# EAGLE design Brain Conn Disconnect (6 - straight) (EAGLE 9.6.2)
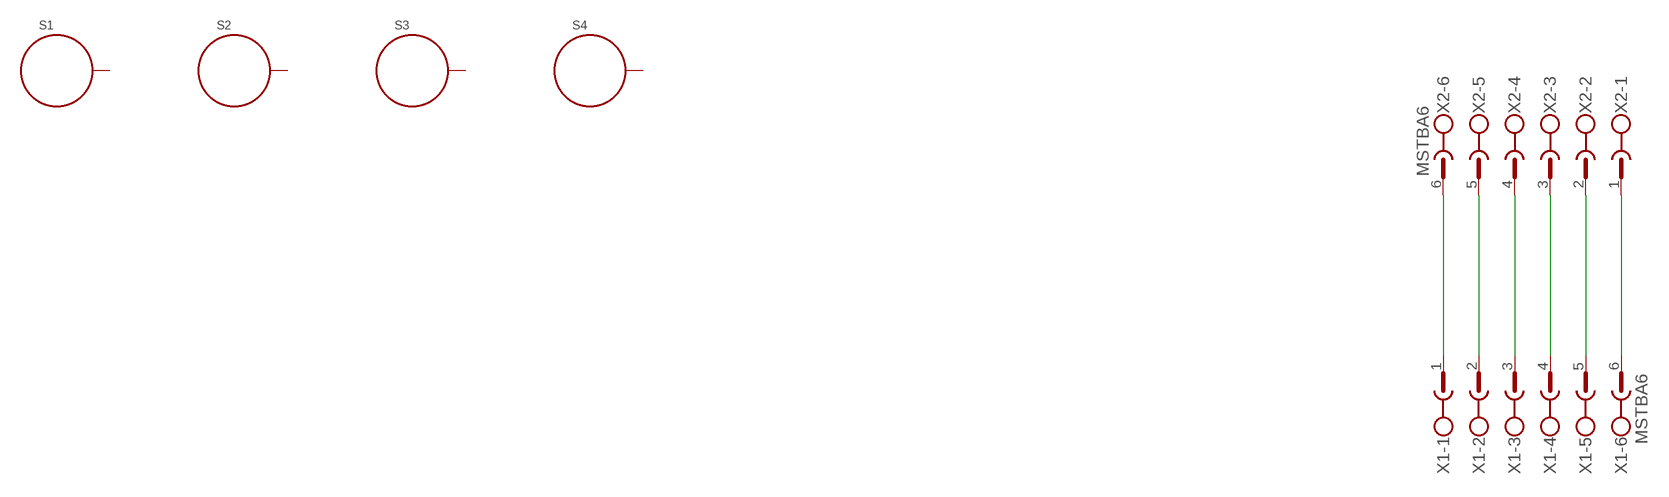
[diagram p0: schematic, sheet 1]

## Parts
S1  STANDOFF_ELECTRICAL144  [STANDOFF_ELECTRICAL_144MILL_NORMAL_SCREW]
S2  STANDOFF_ELECTRICAL144  [STANDOFF_ELECTRICAL_144MILL_NORMAL_SCREW]
S3  STANDOFF_ELECTRICAL144  [STANDOFF_ELECTRICAL_144MILL_NORMAL_SCREW]
S4  STANDOFF_ELECTRICAL144  [STANDOFF_ELECTRICAL_144MILL_NORMAL_SCREW]
X1  MSTBA6  [MSTBA6]
X2  MSTBA6  [MSTBA6]

## Nets
N$1: X1.1 X2.6
N$2: X1.2 X2.5
N$3: X1.3 X2.4
N$4: X1.4 X2.3
N$5: X1.5 X2.2
N$6: X1.6 X2.1
Unconnected: S1.P1 S2.P1 S3.P1 S4.P1

## Library data of the parts
S1-S4 = th_libraries:STANDOFF_ELECTRICAL: A standoff intended to be an electrically connected point. Pad size and stop size allow for a #8 Phillips pan screw head to make a solid connection to the board. Added 144mill drill hole that fits my normal wood screw
X1 X2 = con-phoenix-508:MSTBA6: PHOENIX; MF: FARNELL; MPN: 1757284; OC_FARNELL: 3705213; OC_NEWARK: 71C4165

## Board
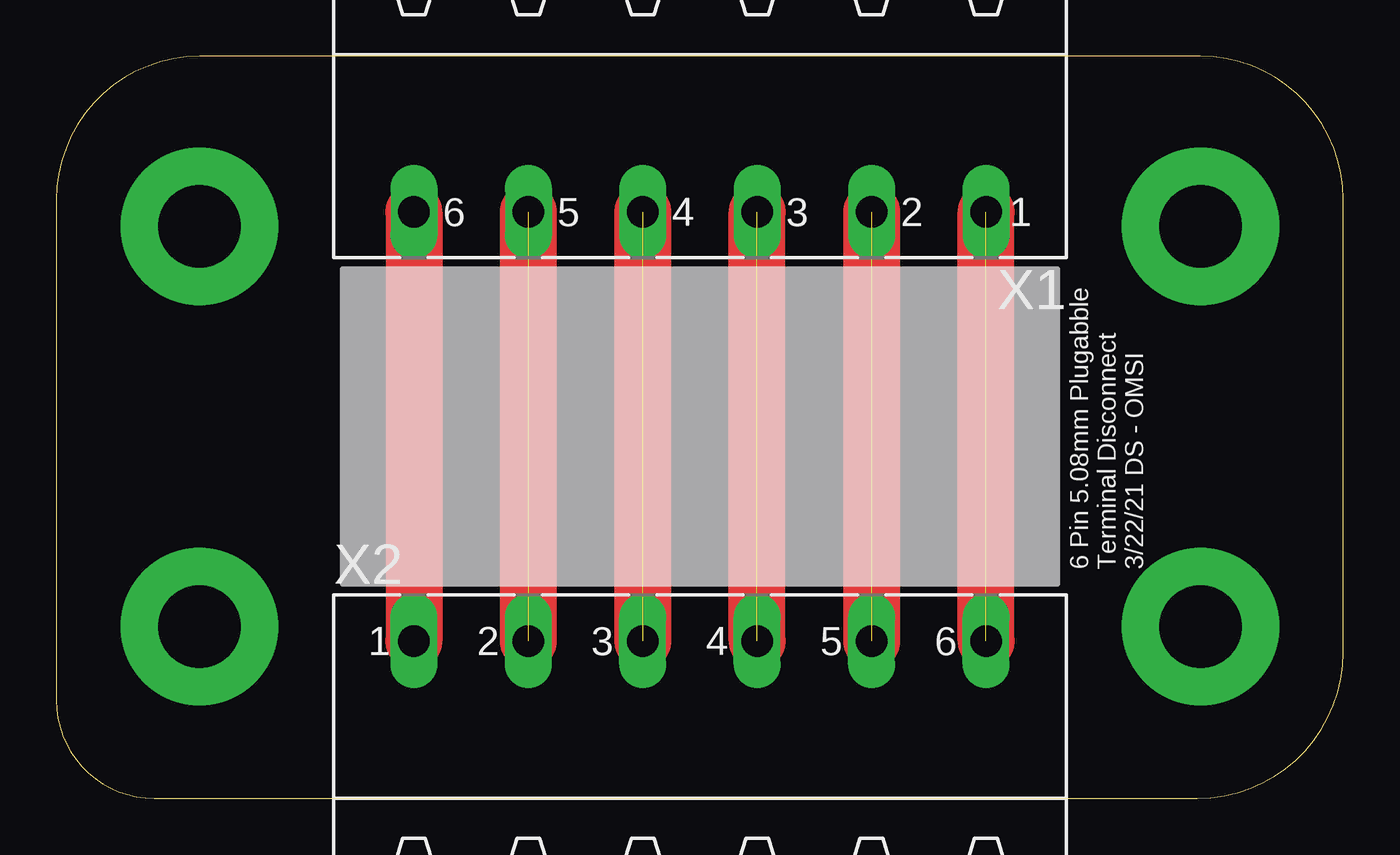
[diagram p1: board, top side]

Size 57.13 x 32.94 mm. Coordinates in mm from the lower left corner, seen from the top.
Outline: 57.13,6.47 57.13,26.6 arc90 50.79,32.94 6.37,32.94 arc90 0,26.57 0,4.34 arc90 4.34,0 50.66,0 arc90 57.13,6.47
Copper layers (1*16): Top 0.035mm / dielectric 1.5mm / Bottom 0.035mm
Design rules "default": minimum track width 6mil, minimum drill 0.35mm, track to track 6mil, track to pad 6mil, pad to pad 6mil, via to via 6mil, smd to smd 6mil, copper to edge 40mil, drill to drill 6mil, minimum pad ring 10mil, minimum via ring 8mil, stop-mask expansion 4mil, vias tented up to drill 0mil, thermal gap 10mil

### Footprints (pad centres in the part's own frame; a part is rotated, then mirrored left to right if it is on the bottom)
STANDOFF_ELECTRICAL_144MILL_NORMAL_SCREW = drill 3.658 pad 6.985: P1 0,0
MSTBA6 = drill 1.397 long: 1 -12.7,5.08; 2 -7.62,5.08; 3 -2.54,5.08; 4 2.54,5.08; 5 7.62,5.08; 6 12.7,5.08

### Placement (x,y rotation side)
S1  6.35,7.62 0 top
S2  6.35,25.4 0 top
S3  50.8,7.62 0 top
S4  50.8,25.4 0 top
X1  28.57,31.12 180 top
X2  28.57,1.91 0 top

### Tracks (layer width: path | path; a pad name or v marks a point on that pad's centre or on a via)
N$1  (1 unrouted)
  Top 2.54: X2.6 X1.1
N$2  (1 unrouted)
  Top 2.54: X1.2 X2.5
N$3  (1 unrouted)
  Top 2.54: X2.4 X1.3
N$4  (1 unrouted)
  Top 2.54: X1.4 X2.3
N$5  (1 unrouted)
  Top 2.54: X2.2 X1.5
N$6
  Top 2.54: X1.6 X2.1

### Text on the board
tPlace: 6 Pin 5.08mm Plugabble / Terminal Disconnect / 3/22/21 DS - OMSI | OMSI Brain Basics / Disconnect Board / 3-22-21 DS